# Altium schematic sheet Sheet1.SchDoc
size 420 x 297 mm; Address1: Address1; Address2: Address2; Address3: Address3; Address4: Address4; DocumentNumber: АБВГ.123456.001 Э3; SheetNumber: 1; Scale: 1:1; DocumentType: Схема электрическая принципиальная; FirstReferrence: АБВГ.123456.001
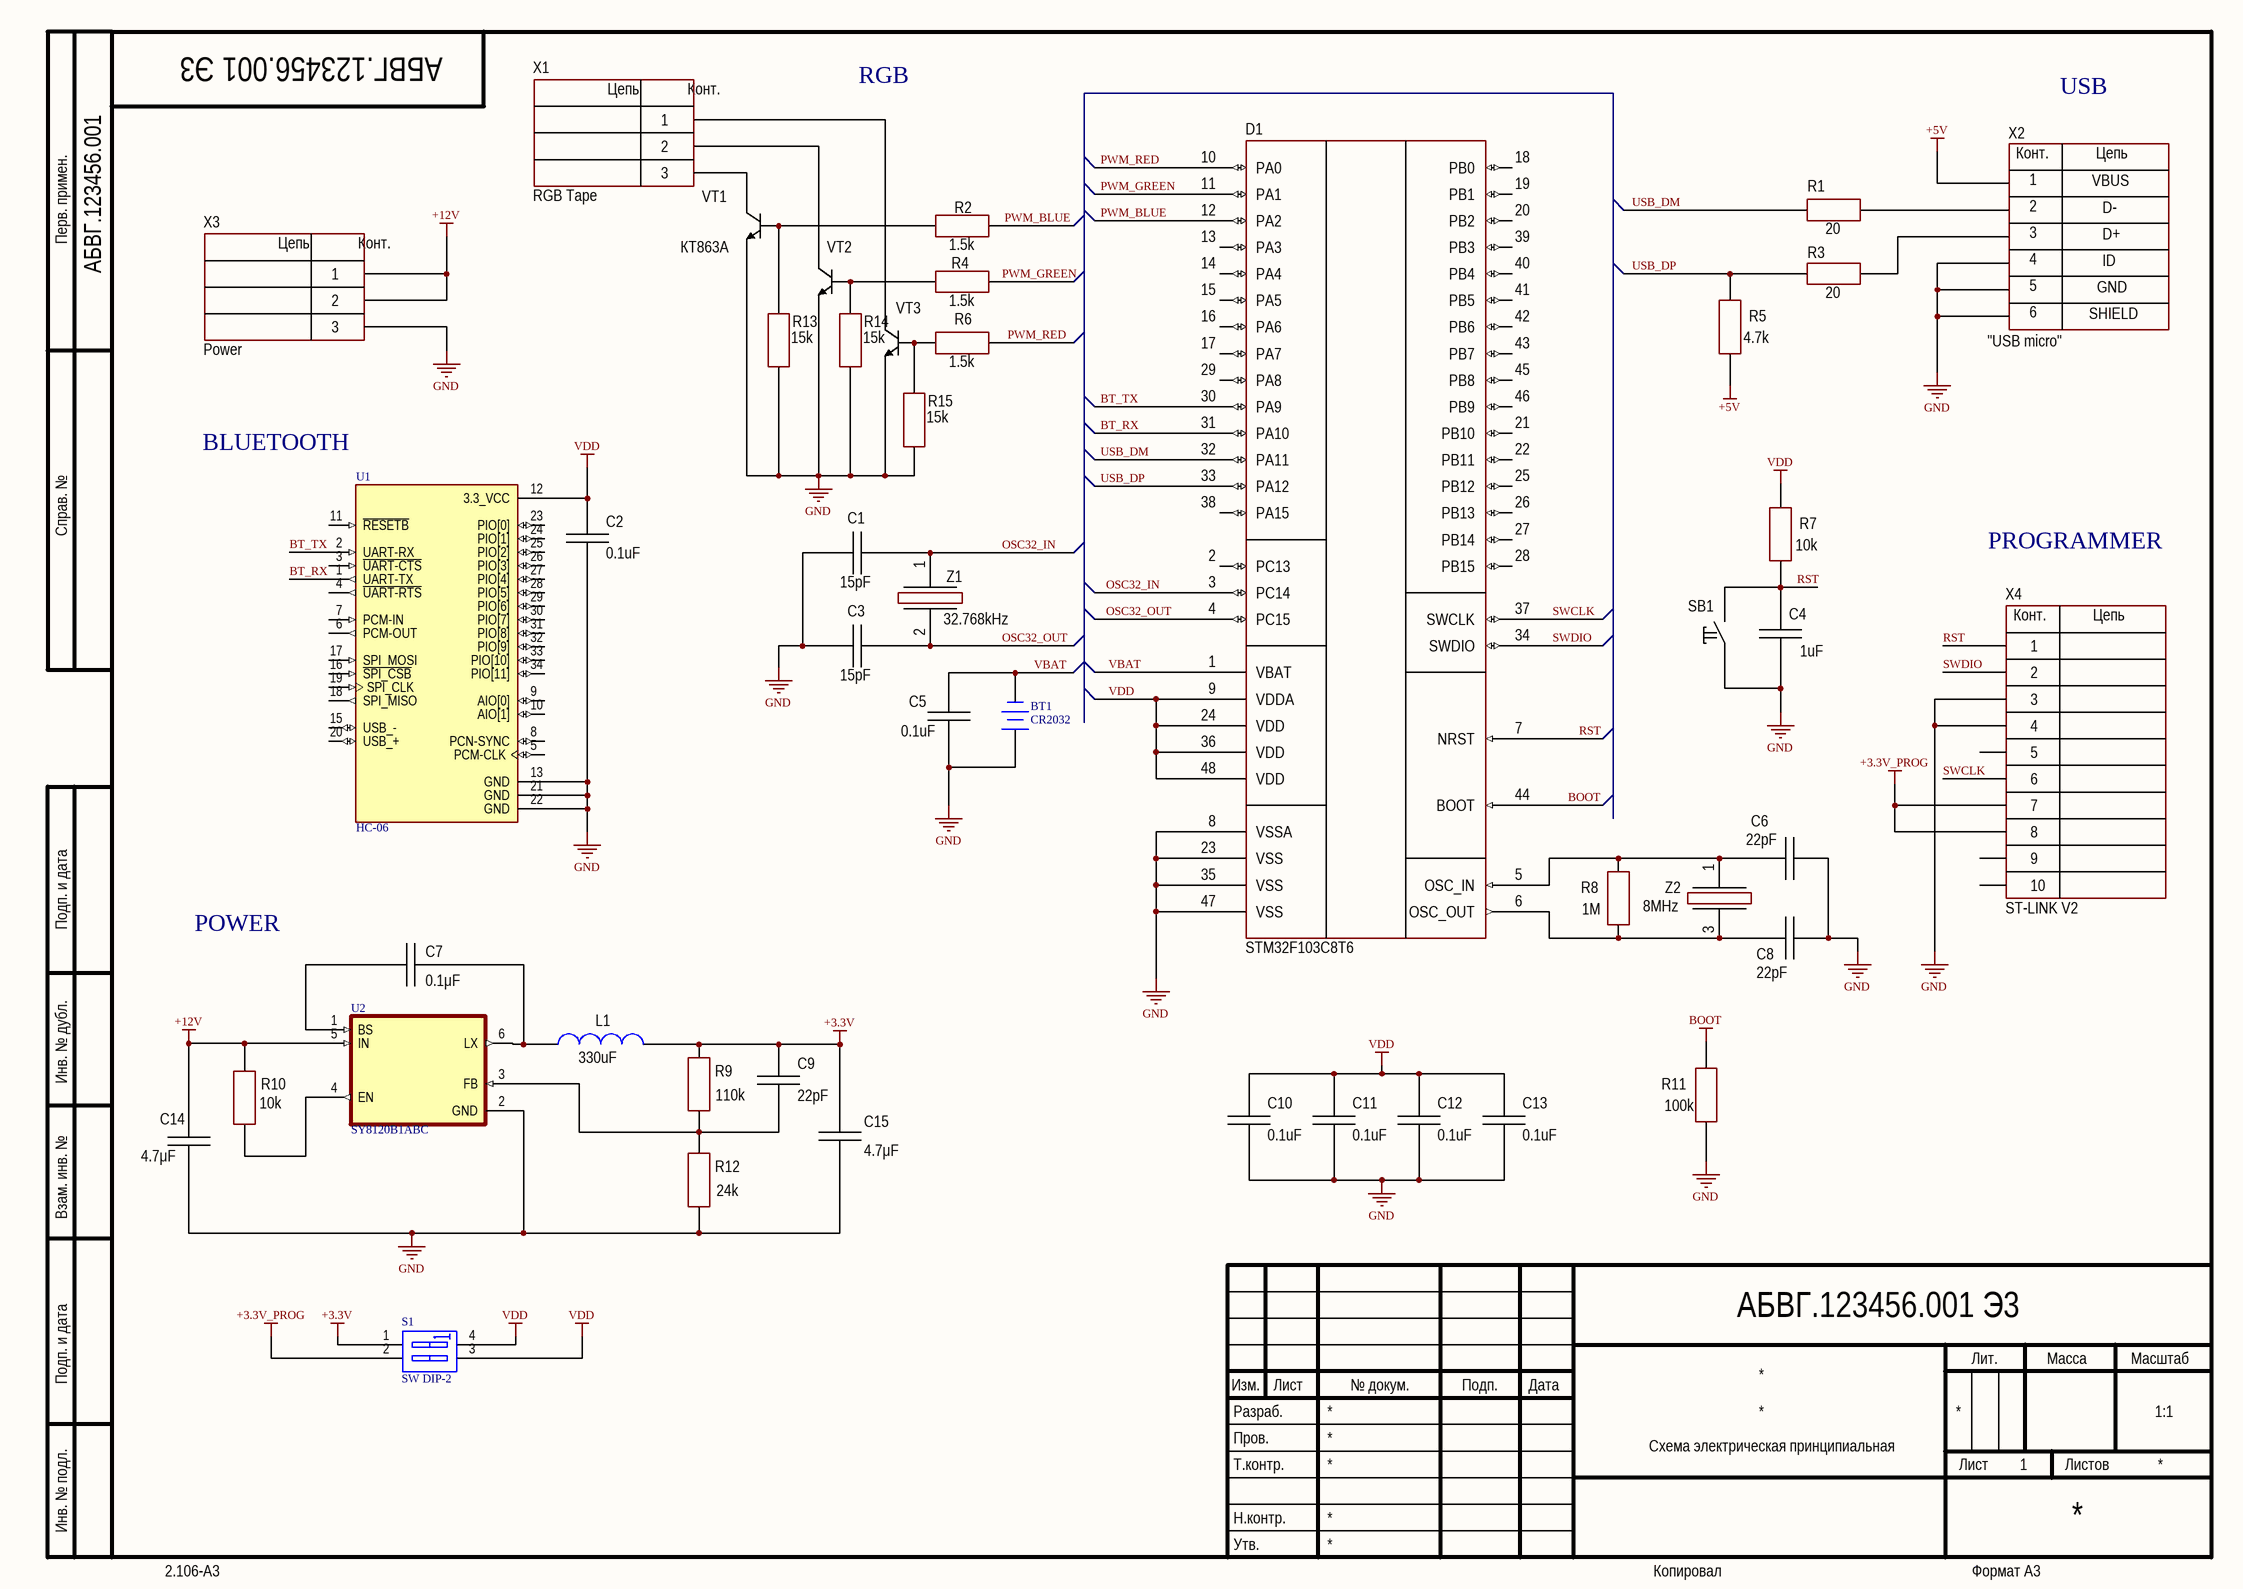
[diagram p0: Sheet1.SchDoc]

## Parts
BT1  CR2032  [BAT-2]
C1  15pF  [CH1206C]
C2  value 0.1uF  [CAP: 1206]
C3  15pF  [CH1206C]
C4  1uF  [CH1206C]
C5  value 0.1uF  [CAP: 1206]
C6  22pF  [CH1206C]
C7  value 0.1μF  [CAP: 1206]
C8  22pF  [CH1206C]
C9  value 22pF  [CAP: 1206]
C10  value 0.1uF  [CAP: 1206]
C11  value 0.1uF  [CAP: 1206]
C12  value 0.1uF  [CAP: 1206]
C13  value 0.1uF  [CAP: 1206]
C14  value 4.7μF  [CAP: 1206]
C15  value 4.7μF  [CAP: TANTAL-A]
D1  (no value)  [48-LQFP]
L1  330uF  [IND: CD43]
R1  20  [CH1206R]
R2  1.5k  [CH1206R]
R3  20  [CH1206R]
R4  1.5k  [CH1206R]
R5  4.7k  [CH1206R]
R6  1.5k  [CH1206R]
R7  10k  [CH1206R]
R8  1M  [CH1206R]
R9  110k  [CH1206R]
R10  10k  [CH1206R]
R11  100k  [CH1206R]
R12  24k  [CH1206R]
R13  15k  [CH1206R]
R14  15k  [CH1206R]
R15  15k  [CH1206R]
S1  SW DIP-2  [DIP-4]
SB1  "Кнопка"  [BUT: SKQGADE010]  (value not drawn)
U1  HC-06  [XCVR_HC-05]
U2  SY8120B1ABC  [SOT95P280X145-6N]
VT1  КТ863А  [TO220_123_H]
VT2  КТ863А  [TO220_123_H]  (value not drawn)
VT3  КТ863А  [TO220_123_H]  (value not drawn)
X1  RGB Tape  [CON: 300-03P-5.0]
X2  "USB micro"  [CON: USB-A micro]
X3  Power  [CON: 300-03P-5.0]
X4  ST-LINK V2  [CON: IDC-10MS]
Z1  Frequency: 32.768kHz  [OSC: 3215]
Z2  8MHz  [OSC: 3215]

## Nets
+3.3V: C9.2 C15.2 L1.1 R9.2 S1.1(A1)
+3.3V_PROG: S1.2(A2) X4.7 X4.8
+5V: R5.1 X2.1
+12V: C14.2 R10.2 U2.5(IN) X3.1 X3.2
BOOT: D1.44(BOOT) R11.2
GND: BT1.1(+) C1.2 C2.1 C3.2 C4.1 C5.1 C6.1 C8.1 C10.1 C11.1 C12.1 C13.1 C14.1 C15.1 D1.8(VSSA) D1.23(VSS) D1.35(VSS) D1.47(VSS) R11.1 R12.1 R13.1 R14.1 R15.1 SB1.1 U1.13(GND) U1.21(GND) U1.22(GND) U2.2(GND) VT1.3(E) VT2.3(E) VT3.3(E) X2.0 X2.4 X2.5 X3.3 X4.3 X4.4
VDD: C2.2 C10.2 C11.2 C12.2 C13.2 D1.9(VDDA) D1.24(VDD) D1.36(VDD) D1.48(VDD) R7.2 S1.3(B2) S1.4(B1) U1.12(3.3_VCC)
BT_RX: D1.31(PA10) U1.1(UART-TX)
BT_TX: D1.30(PA9) U1.2(UART-RX)
OSC32_IN: C1.1 D1.3(PC14) Z1.1
OSC32_OUT: C3.1 D1.4(PC15) Z1.2
PWM_BLUE: D1.12(PA2) R2.2
PWM_GREEN: D1.11(PA1) R4.2
PWM_RED: D1.10(PA0) R6.2
RST: C4.2 D1.7(NRST) R7.1 SB1.2 X4.1
SWCLK: D1.37(SWCLK) X4.6
SWDIO: D1.34(SWDIO) X4.2
USB_DM: D1.32(PA11) R1.1
USB_DP: D1.33(PA12) R3.1 R5.2
VBAT: BT1.2(-) C5.2 D1.1(VBAT)
NetC6_2: C6.2 D1.5(OSC_IN) R8.2 Z2.1
NetC7_1: C7.1 L1.2 U2.6(LX)
NetC7_2: C7.2 U2.1(BS)
NetC8_2: C8.2 D1.6(OSC_OUT) R8.1 Z2.3
NetC9_1: C9.1 R9.1 R12.2 U2.3(FB)
NetR1_2: R1.2 X2.2
NetR2_1: R2.1 R13.2 VT1.1(B)
NetR3_2: R3.2 X2.3
NetR4_1: R4.1 R14.2 VT2.1(B)
NetR6_1: R6.1 R15.2 VT3.1(B)
NetR10_1: R10.1 U2.4(EN)
NetVT1_2: VT1.2(C) X1.3
NetVT2_2: VT2.2(C) X1.2
NetVT3_2: VT3.2(C) X1.1

Not connected (* = marked no-connect by the designer): D1 2(PC13) 13(PA3) 14(PA4) 15(PA5) 16(PA6) 17(PA7) 18(PB0) 19(PB1) 20(PB2) 21(PB10) 22(PB11) 25(PB12) 26(PB13) 27(PB14) 28(PB15) 29(PA8) 38(PA15) 39(PB3) 40(PB4) 41(PB5) 42(PB6) 43(PB7) 45(PB8) 46(PB9); U1 3(~{UART-CTS}) 4(~{UART-RTS}) 5(PCM-CLK) 6(PCM-OUT) 7(PCM-IN) 8(PCN-SYNC) 9(AIO[0]) 10(AIO[1]) 11(~{RESETB}) 15(USB_-) 16(~{SPI_CSB}) 17(SPI_MOSI) 18(SPI_MISO) 19(SPI_CLK) 20(USB_+) 23(PIO[0]) 24(PIO[1]) 25(PIO[2]) 26(PIO[3]) 27(PIO[4]) 28(PIO[5]) 29(PIO[6]) 30(PIO[7]) 31(PIO[8]) 32(PIO[9]) 33(PIO[10]) 34(PIO[11]); X4 5 9 10

## Notes on the sheet
- RGB
- USB
- BLUETOOTH
- PROGRAMMER
- POWER
- Перв. примен.
- Справ. №
- Подп. и дата
- Инв. № дубл.
- Взам. инв. №
- Разраб.
- Изм.
- Лист
- № докум.
- Подп.
- Дата
- Лит.
- Масса
- Масштаб
- Пров.
- Т.контр.
- Листов
- Инв. № подл.
- Утв.
- Н.контр.
- 2.106-A3
- Копировал
- Формат А3
- (in symbol 3-Connector) Цепь; Конт.
- (in symbol 10-Connector) Конт.; Цепь
- (in symbol USB-AM) Конт.; Цепь; VBUS; D-; D+; ID; GND; 6; SHIELD

## Library data of the parts
BT1 = Battery: Multicell Battery; Published: 24-Mar-1999; LatestRevisionDate: 17-Jul-2002; LatestRevisionNote: Re-released for DXP Platform.; PackageReference: BAT-2; Publisher: Altium Limited; PackageDescription: Battery; 2 Leads
C1 C3 C4 C6 C8 = Capacitor: Manufacturer: *; Model: *; HelpURL: *; ComponentKind: *; Value: *
C2 C5 C10-C13 = Ceramic_1206: Manufacturer: Yageo; PartNumber: CC1206KRX7R9BB104; ValueManufacturerPartNumber: Ceramic capacitor, 0.1uF, X7R, ±10%, 50V, 1206, -55...+125°C; TypeCapacitor: Ceramic capacitor; Tolerance: ±10%; TypeDielectric: X7R; Voltage: 50V; Package: 1206; HelpURL: https://www.digikey.com/product-detail/en/yageo/CC1206KRX7R9BB104/311-1179-1-ND/303089; Temperature: -55...+125°C
C7 = Ceramic_1206: Manufacturer: Yageo; PartNumber: CC1206KRX7R9BB104; ValueManufacturerPartNumber: Ceramic capacitor, 0.1μF, X7R, ±10%, 50V, 1206, -55...+125°C; TypeCapacitor: Ceramic capacitor; Tolerance: ±10%; TypeDielectric: X7R; Voltage: 50V; Package: 1206; HelpURL: https://www.digikey.com/product-detail/en/yageo/CC1206KRX7R9BB104/311-1179-1-ND/303089; Temperature: -55...+125°C
C9 = Ceramic_1206: Manufacturer: Yageo; PartNumber: CC1206KRX7R9BB104; ValueManufacturerPartNumber: Ceramic capacitor, 22pF, X7R, ±10%, 50V, 1206, -55...+125°C; TypeCapacitor: Ceramic capacitor; Tolerance: ±10%; TypeDielectric: X7R; Voltage: 50V; Package: 1206; HelpURL: https://www.digikey.com/product-detail/en/yageo/CC1206KRX7R9BB104/311-1179-1-ND/303089; Temperature: -55...+125°C
C14 = Ceramic_1206: Manufacturer: Yageo; PartNumber: CC1206KRX7R9BB104; ValueManufacturerPartNumber: Ceramic capacitor, 4.7μF, X7R, ±10%, 50V, 1206, -55...+125°C; TypeCapacitor: Ceramic capacitor; Tolerance: ±10%; TypeDielectric: X7R; Voltage: 50V; Package: 1206; HelpURL: https://www.digikey.com/product-detail/en/yageo/CC1206KRX7R9BB104/311-1179-1-ND/303089; Temperature: -55...+125°C
C15 = Tantal_B: Manufacturer: AVX; PartNumber: F930J227KBA; ValueManufacturerPartNumber: Tantalum capacitor, 4.7μF, 6.3V, ±10%, 1.2Ohm, case B (3528), -55...+125°C; Impedance: 1.2Ohm; Tolerance: ±10%; TypeDielectric: X7R; TypeCapacitor: Tantalum capacitor; Voltage: 6.3V; Package: case B (3528); HelpURL: https://www.digikey.com/product-detail/en/avx-corporation/F930J227KBA/478-8166-1-ND/4005570; Temperature: -55...+125°C
D1 = STM32F103C8T6: Cortex-M3; Manufacturer: STMicroelectronics; ValueManufacturerPartNumber: IC microcontroller, 32-Bit, Cortex-M3, 72MHz, 64KB, 20KB, 2...3.6V, -40...+85°C, 48-LQFP; Supply: 2...3.6V; Speed: 72MHz; CoreSize: 32-Bit; MemoryROM: 64KB; MemoryRAM: 20KB; HelpURL: https://www.digikey.com/product-detail/en/stmicroelectronics/STM32F103C8T6TR/497-17666-1-ND/7804402; Package: 48-LQFP; ComponentType: IC microcontroller; Temperature: -40...+85°C; CoreProcessor: Cortex-M3; PartNumber: STM32F103C8T6
L1 = Inductor: Manufacturer: *; Model: *; HelpURL: *; ComponentKind: *; Value: *
R1-R15 = Resistor: Manufacturer: *; Model: *; HelpURL: *; ComponentKind: *; Value: *
S1 = SW DIP-2: DIP Switch, 2 Position, SPST; Published: 24-Mar-1999; LatestRevisionDate: 17-Jul-2002; LatestRevisionNote: Re-released for DXP Platform.; PackageReference: DIP-4; Publisher: Altium Limited
SB1 = Tactile switches: 6x6 mm; Manufacturer: *; Model: *; HelpURL: *; ComponentKind: *
U1 = HC-05: Bluetooth to Serial Port Module; MF: Bel Power solution; Value: *; Availability: Unavailable; Price: None; SnapEDA_Link: https://www.snapeda.com/parts/HC-05/Bel%20Power%20Solutions/view-part/106410/?ref=snap; Check_prices: https://www.snapeda.com/parts/HC-05/Bel%20Power%20Solutions/view-part/106410/?ref=eda; Package: SOIC-14; MP: HC-05
U2 = TPS2553DBVT: 75mA - 1.5A, adjustable ILIMIT, 2.5-6.5V, high enable, power switch, 85 mOhm 6-SOT-23 -40 to 85; MF: Texas Instruments; Price: None; Value: *; Check_prices: https://www.snapeda.com/parts/TPS2553DBVT/Texas%20Instruments/view-part/425867/?ref=eda; Purchase-URL: https://pricing.snapeda.com/search/part/TPS2553DBVT/?ref=eda; Package: SOT-23-6 Texas Instruments; SnapEDA_Link: https://www.snapeda.com/parts/TPS2553DBVT/Texas%20Instruments/view-part/425867/?ref=snap; Availability: Warning; MP: TPS2553DBVT
VT1-VT3 = NPN: Bipolar; Model: *; Manufacturer: *; ComponentKind: *; HelpURL: *
X1 X3 = 3-Connector: Model: *; Manufacturer: *; HelpURL: *; ComponentKind: *
X2 = USB-AM: USB; Manufacturer: Hirose; Model: ZX62-B-5PA; HelpURL: https://lcsc.com/product-detail/USB-Connectors_HRS_ZX62-B-5PA-33_ZX62-B-5PA-33_C132561.html; ComponentKind: type micro A
X4 = 10-Connector: Model: *; Manufacturer: *; HelpURL: *; ComponentKind: *
Z1 = Crystal_3215: Manufacturer: Epson; PartNumber: FC-135 32.7680KA-A5; ValueManufacturerPartNumber: Crystal, 32.768kHz, 12.5pF, ±20ppm, case 3215, -40...+85°C; LoadCapacitance: 12.5pF; Tolerance: ±20ppm; Package: case 3215; HelpURL: https://www.digikey.com/product-detail/en/epson/FC-135-32.7680KA-A5/SER4103CT-ND/6188447; Temperature: -40...+85°C; TypeOscilator: Crystal
Z2 = Oscillator: Manufacturer: *; Model: *; HelpURL: *; ComponentKind: *; Value: *